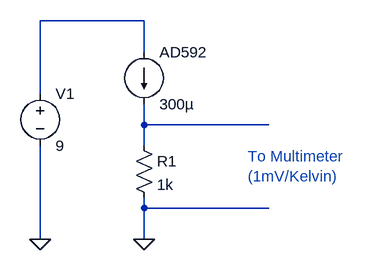
[diagram p0: schematic AD592_thermometer.asc]
AD592_thermometer.asc, the LTspice schematic file:
Version 4
SHEET 1 880 680
WIRE 176 32 16 32
WIRE 176 80 176 32
WIRE 16 144 16 32
WIRE 176 192 176 160
WIRE 368 192 176 192
WIRE 176 224 176 192
WIRE 176 320 176 304
WIRE 368 320 176 320
WIRE 16 368 16 224
WIRE 176 368 176 320
FLAG 16 368 0
FLAG 176 368 0
SYMBOL current 176 80 R0
WINDOW 123 0 0 Left 2
WINDOW 39 0 0 Left 2
SYMATTR InstName AD592
SYMATTR Value 300µ
SYMBOL voltage 16 128 R0
WINDOW 123 0 0 Left 2
WINDOW 39 0 0 Left 2
SYMATTR InstName V1
SYMATTR Value 9
SYMBOL res 160 208 R0
SYMATTR InstName R1
SYMATTR Value 1k
TEXT 336 240 Left 2 ;To Multimeter\n(1mV/Kelvin)

The netlist it stands for:
* AD592_thermometer.asc
I§AD592 N001 N002 300µ
V1 N001 0 9
R1 N002 0 1k
* To Multimeter
* (1mV/Kelvin)
.backanno
.end